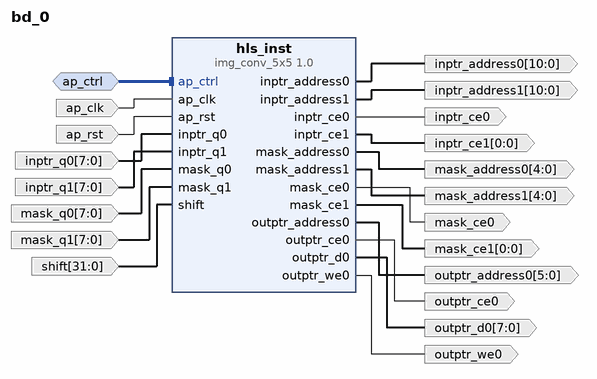
[diagram p0: block diagram of the top level]
# Vivado block design bd_0, xa7z030fbv484-1I, Vivado 2018.3
create_bd_design bd_0

create_bd_intf_port -mode Slave -vlnv xilinx.com:interface:acc_handshake_rtl:1.0 ap_ctrl
create_bd_port -dir I -type clk ap_clk
set_property -dict {CONFIG.FREQ_HZ 100000000.0} [get_bd_ports ap_clk]
create_bd_port -dir I -type rst ap_rst
set_property -dict {CONFIG.POLARITY ACTIVE_HIGH} [get_bd_ports ap_rst]
create_bd_port -dir O -from 10 -to 0 -type data inptr_address0
create_bd_port -dir O -from 10 -to 0 -type data inptr_address1
create_bd_port -dir O inptr_ce0
create_bd_port -dir O -from 0 -to 0 -type data inptr_ce1
create_bd_port -dir I -from 7 -to 0 -type data inptr_q0
set_property -dict [list \
  CONFIG.LAYERED_METADATA {xilinx.com:interface:datatypes:1.0 {DATA {datatype {name {attribs {resolve_type immediate dependency {} format string minimum {} maximum {}} value {}} bitwidth {attribs {resolve_type immediate dependency {} format long minimum {} maximum {}} value 8} bitoffset {attribs {resolve_type immediate dependency {} format long minimum {} maximum {}} value 0} integer {signed {attribs {resolve_type immediate dependency {} format bool minimum {} maximum {}} value false}}}}}} \
] [get_bd_ports inptr_q0]
create_bd_port -dir I -from 7 -to 0 -type data inptr_q1
set_property -dict [list \
  CONFIG.LAYERED_METADATA {xilinx.com:interface:datatypes:1.0 {DATA {datatype {name {attribs {resolve_type immediate dependency {} format string minimum {} maximum {}} value {}} bitwidth {attribs {resolve_type immediate dependency {} format long minimum {} maximum {}} value 8} bitoffset {attribs {resolve_type immediate dependency {} format long minimum {} maximum {}} value 0}}}}} \
] [get_bd_ports inptr_q1]
create_bd_port -dir O -from 4 -to 0 -type data mask_address0
create_bd_port -dir O -from 4 -to 0 -type data mask_address1
create_bd_port -dir O mask_ce0
create_bd_port -dir O -from 0 -to 0 -type data mask_ce1
create_bd_port -dir I -from 7 -to 0 -type data mask_q0
set_property -dict [list \
  CONFIG.LAYERED_METADATA {xilinx.com:interface:datatypes:1.0 {DATA {datatype {name {attribs {resolve_type immediate dependency {} format string minimum {} maximum {}} value {}} bitwidth {attribs {resolve_type immediate dependency {} format long minimum {} maximum {}} value 8} bitoffset {attribs {resolve_type immediate dependency {} format long minimum {} maximum {}} value 0} integer {signed {attribs {resolve_type immediate dependency {} format bool minimum {} maximum {}} value true}}}}}} \
] [get_bd_ports mask_q0]
create_bd_port -dir I -from 7 -to 0 -type data mask_q1
set_property -dict [list \
  CONFIG.LAYERED_METADATA {xilinx.com:interface:datatypes:1.0 {DATA {datatype {name {attribs {resolve_type immediate dependency {} format string minimum {} maximum {}} value {}} bitwidth {attribs {resolve_type immediate dependency {} format long minimum {} maximum {}} value 8} bitoffset {attribs {resolve_type immediate dependency {} format long minimum {} maximum {}} value 0}}}}} \
] [get_bd_ports mask_q1]
create_bd_port -dir O -from 5 -to 0 -type data outptr_address0
create_bd_port -dir O outptr_ce0
create_bd_port -dir O -from 7 -to 0 -type data outptr_d0
create_bd_port -dir O outptr_we0
create_bd_port -dir I -from 31 -to 0 -type data shift
set_property -dict [list \
  CONFIG.LAYERED_METADATA {xilinx.com:interface:datatypes:1.0 {DATA {datatype {name {attribs {resolve_type immediate dependency {} format string minimum {} maximum {}} value {}} bitwidth {attribs {resolve_type immediate dependency {} format long minimum {} maximum {}} value 32} bitoffset {attribs {resolve_type immediate dependency {} format long minimum {} maximum {}} value 0} integer {signed {attribs {resolve_type immediate dependency {} format bool minimum {} maximum {}} value true}}}}}} \
] [get_bd_ports shift]

create_bd_cell -type ip -vlnv xilinx.com:hls:img_conv_5x5:1.0 hls_inst

# ---- connections ----

connect_bd_intf_net -intf_net ap_ctrl_0_1 [get_bd_intf_ports ap_ctrl] [get_bd_intf_pins hls_inst/ap_ctrl]
connect_bd_net -net ap_clk_0_1 [get_bd_ports ap_clk] [get_bd_pins hls_inst/ap_clk]
connect_bd_net -net ap_rst_0_1 [get_bd_ports ap_rst] [get_bd_pins hls_inst/ap_rst]
connect_bd_net [get_bd_pins hls_inst/inptr_address0] [get_bd_ports inptr_address0]
connect_bd_net [get_bd_pins hls_inst/inptr_address1] [get_bd_ports inptr_address1]
connect_bd_net [get_bd_pins hls_inst/inptr_ce0] [get_bd_ports inptr_ce0]
connect_bd_net [get_bd_pins hls_inst/inptr_ce1] [get_bd_ports inptr_ce1]
connect_bd_net -net inptr_q0_0_1 [get_bd_ports inptr_q0] [get_bd_pins hls_inst/inptr_q0]
connect_bd_net -net inptr_q1_0_1 [get_bd_ports inptr_q1] [get_bd_pins hls_inst/inptr_q1]
connect_bd_net [get_bd_pins hls_inst/mask_address0] [get_bd_ports mask_address0]
connect_bd_net [get_bd_pins hls_inst/mask_address1] [get_bd_ports mask_address1]
connect_bd_net [get_bd_pins hls_inst/mask_ce0] [get_bd_ports mask_ce0]
connect_bd_net [get_bd_pins hls_inst/mask_ce1] [get_bd_ports mask_ce1]
connect_bd_net -net mask_q0_0_1 [get_bd_ports mask_q0] [get_bd_pins hls_inst/mask_q0]
connect_bd_net -net mask_q1_0_1 [get_bd_ports mask_q1] [get_bd_pins hls_inst/mask_q1]
connect_bd_net [get_bd_pins hls_inst/outptr_address0] [get_bd_ports outptr_address0]
connect_bd_net [get_bd_pins hls_inst/outptr_ce0] [get_bd_ports outptr_ce0]
connect_bd_net [get_bd_pins hls_inst/outptr_d0] [get_bd_ports outptr_d0]
connect_bd_net [get_bd_pins hls_inst/outptr_we0] [get_bd_ports outptr_we0]
connect_bd_net -net shift_0_1 [get_bd_ports shift] [get_bd_pins hls_inst/shift]

validate_bd_design
save_bd_design
